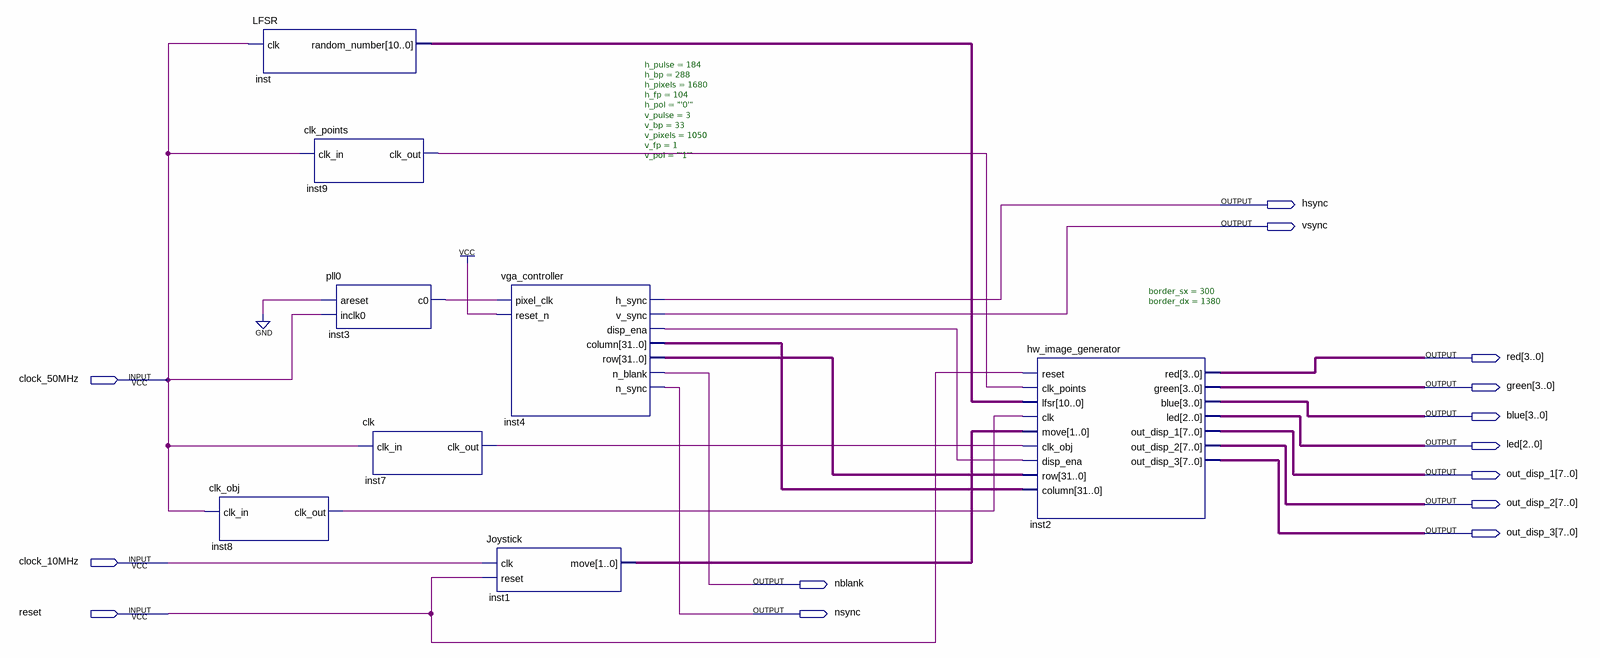
[diagram p0: schematic sheet]
// Quartus schematic TopLevel.bdf as structural Verilog: 8 symbols, 14 pins
module TopLevel (
  input  clock_50MHz,
  input  clock_10MHz,
  input  reset,
  output hsync,
  output vsync,
  output [3:0] red,
  output [3:0] green,
  output [3:0] blue,
  output [2:0] led,
  output [7:0] out_disp_1,
  output [7:0] out_disp_2,
  output [7:0] out_disp_3,
  output nblank,
  output nsync
);

  wire inst3_c0, inst4_disp_ena, inst7_clk_out, inst8_clk_out, inst9_clk_out;
  wire [1:0] inst1_move;
  wire [10:0] inst_random_number;
  wire [31:0] inst4_column, inst4_row;

  LFSR inst (.clk(clock_50MHz), .random_number(inst_random_number));
  clk_obj inst8 (.clk_in(clock_50MHz), .clk_out(inst8_clk_out));
  clk_points inst9 (.clk_in(clock_50MHz), .clk_out(inst9_clk_out));
  pll0 inst3 (.areset(1'b0), .inclk0(clock_50MHz), .c0(inst3_c0));
  clk inst7 (.clk_in(clock_50MHz), .clk_out(inst7_clk_out));
  Joystick inst1 (.clk(clock_10MHz), .reset(reset), .move(inst1_move));
  vga_controller #(.h_pulse(184), .h_bp(288), .h_pixels(1680), .h_fp(104), .h_pol("'0'"), .v_pulse(3), .v_bp(33), .v_pixels(1050), .v_fp(1), .v_pol("'1'")) inst4 (
    .pixel_clk(inst3_c0), .reset_n(1'b1), .h_sync(hsync), .v_sync(vsync), .disp_ena(inst4_disp_ena),
    .column(inst4_column), .row(inst4_row), .n_blank(nblank), .n_sync(nsync));
  hw_image_generator #(.border_sx(300), .border_dx(1380)) inst2 (
    .reset(reset), .clk_points(inst9_clk_out), .lfsr(inst_random_number), .clk(inst8_clk_out),
    .move(inst1_move), .clk_obj(inst7_clk_out), .disp_ena(inst4_disp_ena), .row(inst4_row),
    .column(inst4_column), .red(red), .green(green), .blue(blue), .led(led), .out_disp_1(out_disp_1),
    .out_disp_2(out_disp_2), .out_disp_3(out_disp_3));
endmodule
